# Altium project PCB_TP1.PrjPcb
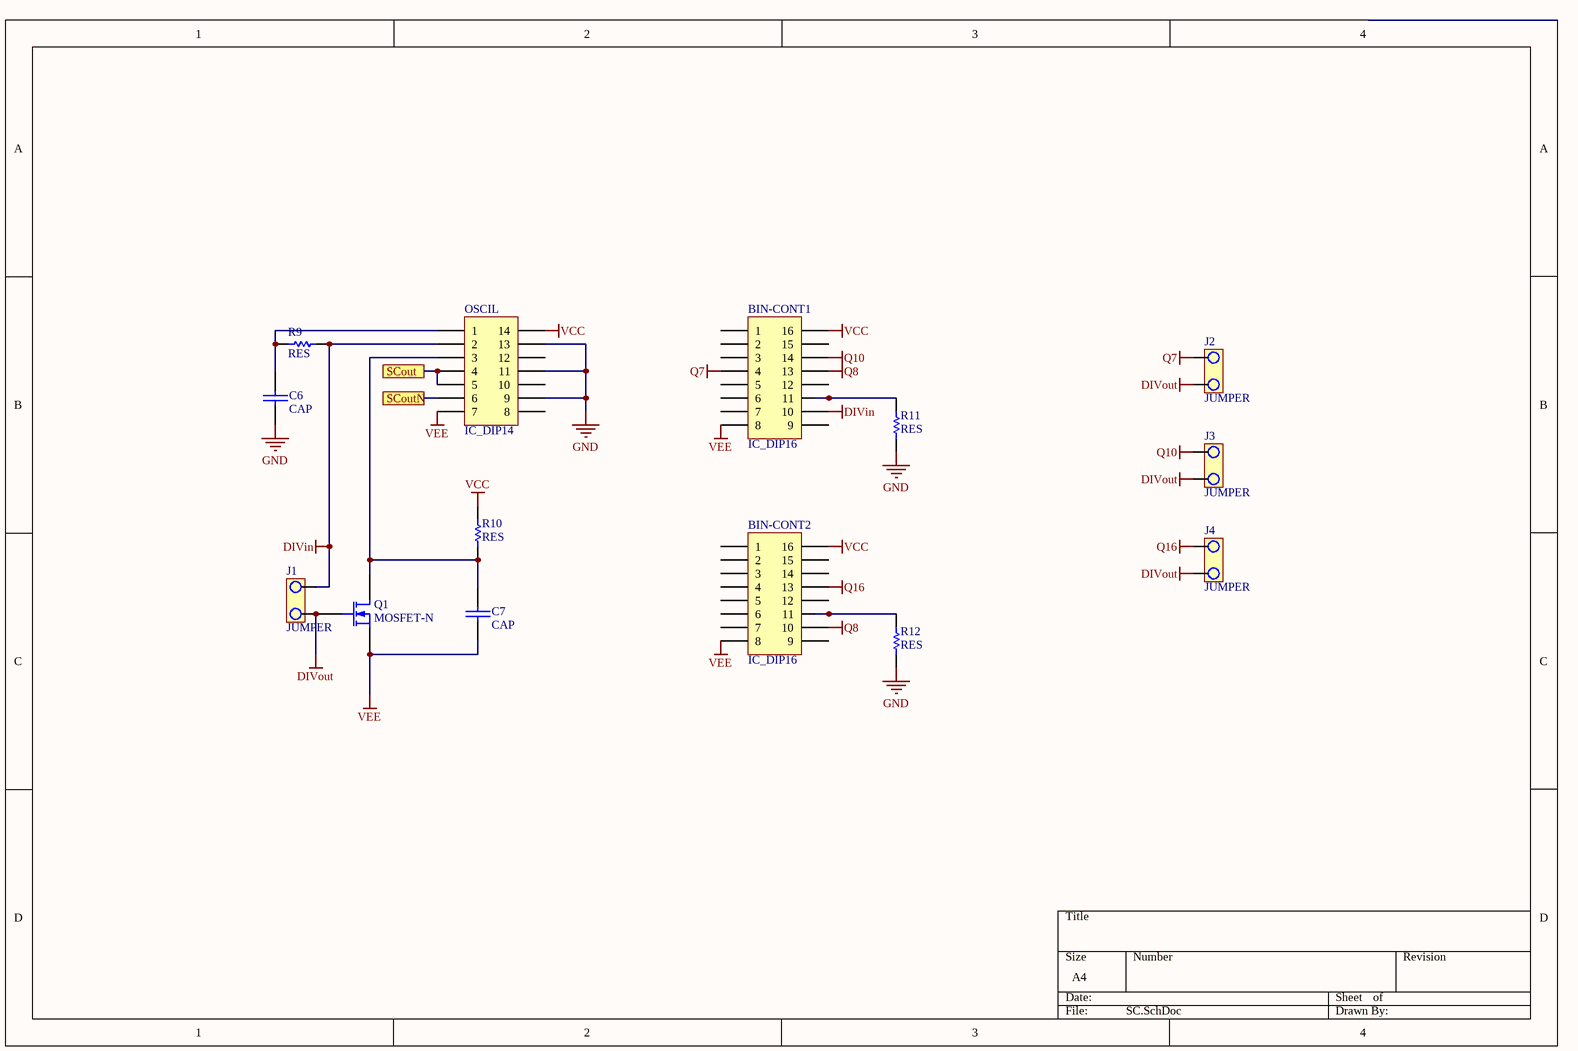
[diagram p0: SC.SchDoc]
5 sheets, 66 parts. Net scope: hierarchical (ports join the sheet entries above them; power ports are global).
Board files: PCB1.PcbDoc, PCB2.PcbDoc
Sheets:
  SC.SchDoc
  SH.SchDoc
  LLA.SchDoc
  FAA.SchDoc
    U_2T 1 = 2T.SchDoc
    U_2T 2 = 2T.SchDoc
    U_2T 3 = 2T.SchDoc
    U_2T 4 = 2T.SchDoc

## Sheet SC.SchDoc
size A4

### Parts
BIN-CONT1  IC_DIP16  [D016_M]
BIN-CONT2  IC_DIP16  [D016_M]
C6  CAP  [1206]
C7  CAP  [1206]
J1  JUMPER  [0805]
J2  JUMPER  [0805]
J3  JUMPER  [0805]
J4  JUMPER  [0805]
OSCIL  IC_DIP14  [D014_M]
Q1  MOSFET-N  [SOT-343_M]
R9  RES  [1206]
R10  RES  [1206]
R11  RES  [1206]
R12  RES  [1206]

### Ports
SCout, SCoutN

### Nets
DIVin: BIN-CONT1.10 J1.1 OSCIL.2 R9.2
DIVout: J1.2 J2.1 J3.1 J4.1 Q1.2(G)
GND: C6.1 OSCIL.9 OSCIL.11 OSCIL.13 R11.1 R12.1
Q7: BIN-CONT1.4 J2.2
Q8: BIN-CONT1.13 BIN-CONT2.10
Q10: BIN-CONT1.14 J3.2
Q16: BIN-CONT2.13 J4.2
VCC: BIN-CONT1.16 BIN-CONT2.16 OSCIL.14 R10.2
VEE: BIN-CONT1.8 BIN-CONT2.8 C7.1 OSCIL.7 Q1.3(S)
NetBIN-CONT1_11: BIN-CONT1.11 R11.2
NetBIN-CONT2_11: BIN-CONT2.11 R12.2
NetC6_2: C6.2 OSCIL.1 R9.1
NetC7_2: C7.2 OSCIL.3 Q1.1(D) R10.1
NetOSCIL_4: OSCIL.4 OSCIL.5 ; port SCout
NetOSCIL_6: OSCIL.6 ; port SCoutN

Not connected (* = marked no-connect by the designer): BIN-CONT1 1 2 3 5 6 7 9 12 15; BIN-CONT2 1 2 3 4 5 6 7 9 12 14 15; OSCIL 8 10 12

### Library data of the parts
Q1 = MOSFET-N: N-Channel MOSFET; Published: 8-Jun-2000; LatestRevisionDate: 17-Jul-2002; LatestRevisionNote: Re-released for DXP Platform.; PackageVersion: 1995/1996; PackageReference: E3; Publisher: Altium Limited; PackageDescription: TO, Flat Index; 3 In-Line, Axial Leads; Body Dia. 4.6mm; Lead Dia. 0.5 mm (max)

## Sheet SH.SchDoc
size A4
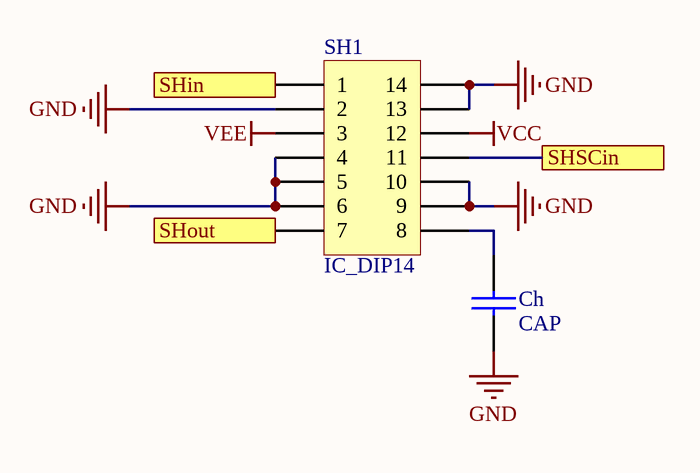
[diagram p1: SH.SchDoc]

### Parts
Ch  CAP  [1206]
SH1  IC_DIP14  [D014_M]

### Ports
SHin, SHout, SHSCin

### Nets
GND: Ch.2 SH1.2 SH1.4 SH1.5 SH1.6 SH1.9 SH1.10 SH1.13 SH1.14
VCC: SH1.12
VEE: SH1.3
NetCh_1: Ch.1 SH1.8
NetSH1_1: SH1.1 ; port SHin
NetSH1_7: SH1.7 ; port SHout
NetSH1_11: SH1.11 ; port SHSCin

## Sheet LLA.SchDoc
size A4
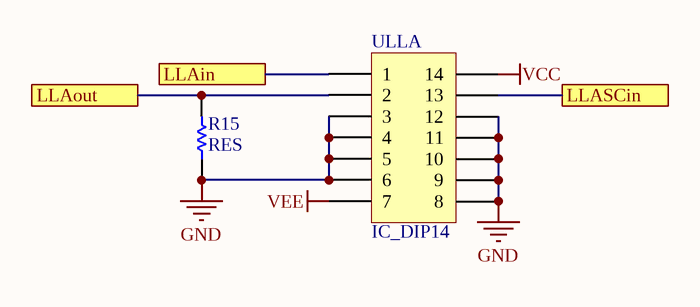
[diagram p2: LLA.SchDoc]

### Parts
R15  RES  [1206]
ULLA  IC_DIP14  [D014_M]

### Ports
LLAin, LLAout, LLASCin

### Nets
GND: R15.1 ULLA.3 ULLA.4 ULLA.5 ULLA.6 ULLA.8 ULLA.9 ULLA.10 ULLA.11 ULLA.12
VCC: ULLA.14
VEE: ULLA.7
NetR15_2: R15.2 ULLA.2 ; port LLAout
NetULLA_1: ULLA.1 ; port LLAin
NetULLA_13: ULLA.13 ; port LLASCin

## Sheet FAA.SchDoc
size A4
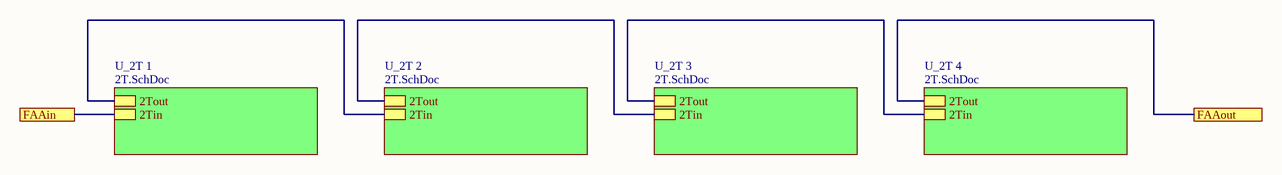
[diagram p3: FAA.SchDoc]

### Sub-sheets
U_2T 1 = 2T.SchDoc: 2Tout, 2Tin
U_2T 2 = 2T.SchDoc: 2Tout, 2Tin
U_2T 3 = 2T.SchDoc: 2Tout, 2Tin
U_2T 4 = 2T.SchDoc: 2Tout, 2Tin

### Ports
FAAin, FAAout

### Nets
NetC3_U_2T_12_2: sheet U_2T 1/2Tout, sheet U_2T 2/2Tin
NetC3_U_2T_22_2: sheet U_2T 2/2Tout, sheet U_2T 3/2Tin
NetC3_U_2T_32_2: sheet U_2T 3/2Tout, sheet U_2T 4/2Tin
NetC3_U_2T_42_2: port FAAout, sheet U_2T 4/2Tout
NetR1_U_2T_12_1: port FAAin, sheet U_2T 1/2Tin

## Sheet 2T.SchDoc
size A4
Used 4 times, as channels U_2T 1, U_2T 2, U_2T 3, U_2T 4. Parts and nets are listed once, with the designators drawn on the sheet.
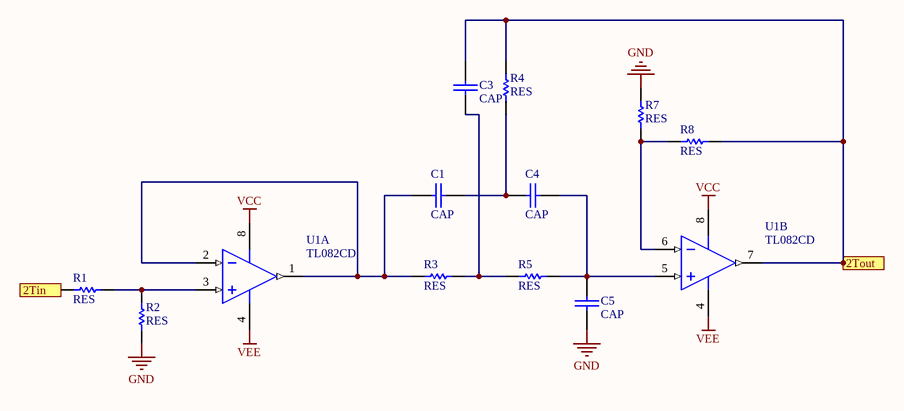
[diagram p4: 2T.SchDoc]

### Parts
C1  CAP  [1206]
C3  CAP  [1206]
C4  CAP  [1206]
C5  CAP  [1206]
R1  RES  [1206]
R2  RES  [1206]
R3  RES  [1206]
R4  RES  [1206]
R5  RES  [1206]
R7  RES  [1206]
R8  RES  [1206]
U1  TL082CD  [TI-D8_M]  (parts A,B of 2)

### Ports
2Tin, 2Tout

### Nets
GND: C5.1 R2.1 R7.2
VCC: U1.8(VCC+)
VEE: U1.4(VCC-)
2Tin: R1.1 ; port 2Tin
2Tout: C3.2 R4.2 R8.1 U1.7(OUT2) ; port 2Tout
NetC1_1: C1.1 R3.1 U1.1(OUT1) U1.2(IN1-)
NetC1_2: C1.2 C4.1 R4.1
NetC3_1: C3.1 R3.2 R5.1
NetC4_2: C4.2 C5.2 R5.2 U1.5(IN2+)
NetR1_2: R1.2 R2.2 U1.3(IN1+)
NetR7_1: R7.1 R8.2 U1.6(IN2-)

### Channels
U_2T 1: designators end in _U_2T_12; ports 2Tin=NetR1_U_2T_12_1 2Tout=NetC3_U_2T_12_2
U_2T 2: designators end in _U_2T_22; ports 2Tin=NetC3_U_2T_12_2 2Tout=NetC3_U_2T_22_2
U_2T 3: designators end in _U_2T_32; ports 2Tin=NetC3_U_2T_22_2 2Tout=NetC3_U_2T_32_2
U_2T 4: designators end in _U_2T_42; ports 2Tin=NetC3_U_2T_32_2 2Tout=NetC3_U_2T_42_2

### Library data of the parts
U1 = TL082CD: JFET-Input Operational Amplifier, 7 to 36 V, 0 to 70 degC, 8-pin SOIC (D8), Green (RoHS & no Sb/Br); Manufacturer: Texas Instruments; CMRR(Min)(dB): 70; GBW(Typ)(MHz): 3; IIB(Max)(pA): 400; Iq per channel(Max)(mA): 2.8; Number of Channels: 2; Offset Drift(Typ)(uV/C): 18; Rating: Catalog; Slew Rate(Typ)(V/us): 13; Sub Family: General Purpose Amplifier, High Supply Voltage Amplifier (>=30V); Total Supply Voltage(Max)(+5V is 5, +/-5V is 10): 36; Total Supply Voltage(Min)(+5V is 5, +/-5V is 10): 7; Vio (25C)(Max)(mV): 15; DatasheetVersion: SLOS081G; PackageVersion: 4040047-3/M, 06/2011; PackageReference: D8; PackageDescription: 8-Pin Plastic Small Outline, Body 4.9 x 3.9 mm, Pitch 1.27 mm; Supplier 1: Digi-Key; Supplier Part Number 1: 296-1284-5-ND; Supplier 2: Farnell; Supplier Part Number 2: 1103183; Supplier 3: Newark; Supplier Part Number 3: 35K1261; Supplier 4: Mouser; Supplier Part Number 4: 595-TL082CD; Eco-Plan: Green (RoHS & no Sb/Br); Vn at 1kHz(Typ)(nV/rtHz): 18; Mounting Technology: Surface Mount; Code_JEDEC: MS-012; PartNumber: TL082CD; ComponentLink1Description: Manufacturer URL; ComponentLink1URL: http://www.ti.com/; ComponentLink2Description: Datasheet; ComponentLink2URL: http://www.ti.com/lit/ds/symlink/tl082.pdf; ComponentLink3Description: Package Specification; ComponentLink3URL: http://www.ti.com/litv/pdf/msoi002j

## Nets that join several sheets
GND: SC (6 pins), SH (9 pins), LLA (10 pins), U_2T 1 (C5_U_2T_12.1 R2_U_2T_12.1 R7_U_2T_12.2), U_2T 2 (C5_U_2T_22.1 R2_U_2T_22.1 R7_U_2T_22.2), U_2T 3 (C5_U_2T_32.1 R2_U_2T_32.1 R7_U_2T_32.2), U_2T 4 (C5_U_2T_42.1 R2_U_2T_42.1 R7_U_2T_42.2)
VCC: SC (BIN-CONT1.16 BIN-CONT2.16 OSCIL.14 R10.2), SH (SH1.12), LLA (ULLA.14), U_2T 1 (U1_U_2T_12.8), U_2T 2 (U1_U_2T_22.8), U_2T 3 (U1_U_2T_32.8), U_2T 4 (U1_U_2T_42.8)
VEE: SC (5 pins), SH (SH1.3), LLA (ULLA.7), U_2T 1 (U1_U_2T_12.4), U_2T 2 (U1_U_2T_22.4), U_2T 3 (U1_U_2T_32.4), U_2T 4 (U1_U_2T_42.4)
NetC3_U_2T_12_2: U_2T 1 (C3_U_2T_12.2 R4_U_2T_12.2 R8_U_2T_12.1 U1_U_2T_12.7), U_2T 2 (R1_U_2T_22.1)
NetC3_U_2T_22_2: U_2T 2 (C3_U_2T_22.2 R4_U_2T_22.2 R8_U_2T_22.1 U1_U_2T_22.7), U_2T 3 (R1_U_2T_32.1)
NetC3_U_2T_32_2: U_2T 3 (C3_U_2T_32.2 R4_U_2T_32.2 R8_U_2T_32.1 U1_U_2T_32.7), U_2T 4 (R1_U_2T_42.1)